# EAGLE design PS2_concentrate (EAGLE 6.2)
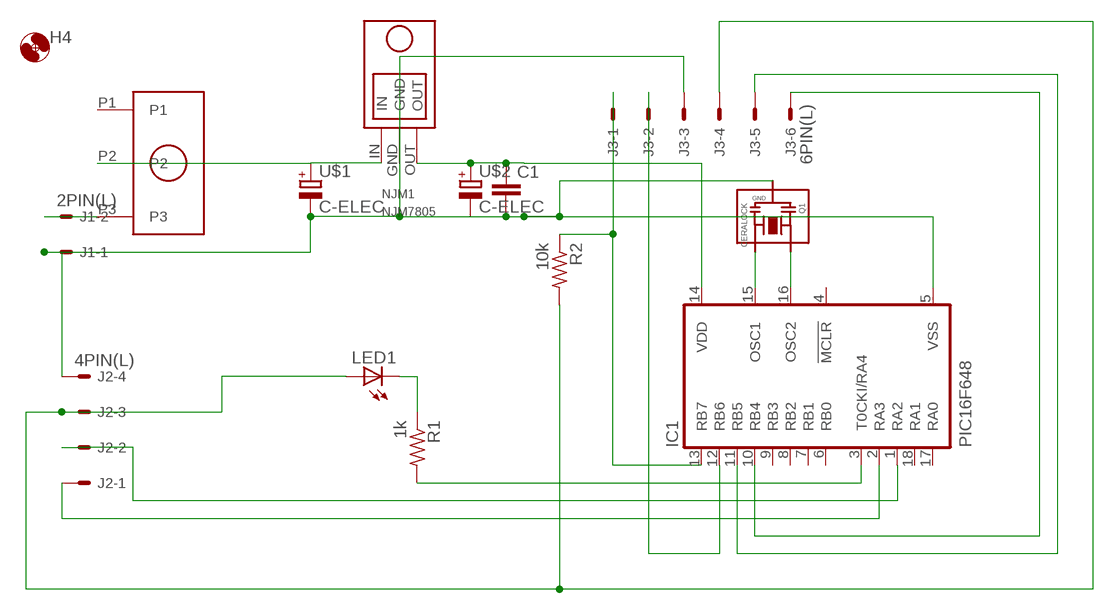
[diagram p0: schematic, sheet 1]

## Parts
C1  C-  [C-2.54]
H4  HOLE3.3M3BOLT  [HOLE3.3]
IC1  PIC16F648  [DIL18]
J1  2PIN(L)  [2PL]
J2  4PIN(L)  [4PL]
J3  6PIN(L)  [6PL]
LED1  LED  [LED5MM]
NJM1  NJM7805  [NJM7805]
Q1  CERALOCK  [CERALOCK]
R1  1k  R-  [0207/10]
R2  10k  R-  [0207/10]
U$1  C-ELEC  [C-6MM]
U$2  C-ELEC  [C-6MM]
U$3  TOGGLE_SEITCH  [TOGGLE_SWITCH]

## Nets
5V: C1.P$1 IC1.14(VDD) J2.3 J3.4 LED1.A NJM1.OUT R2.2 U$2.+
9V: NJM1.IN U$1.+ U$3.P2
A2: IC1.1(RA2) J2.2
A3: IC1.2(RA3) J2.1
A4: IC1.3(T0CKI/RA4) R1.2
B4: IC1.10(RB4) J3.6
B5: IC1.11(RB5) J3.5
B6: IC1.12(RB6) J3.2
B7: IC1.13(RB7) J3.1 R2.1
GND: C1.P$2 IC1.5(VSS) J1.1 J2.4 J3.3 NJM1.GND Q1.P$2 U$1.- U$2.-
N$2: LED1.K(C) R1.1
N$3: J1.2 U$3.P3
N$4: IC1.15(OSC1) Q1.P$3
N$5: IC1.16(OSC2) Q1.P$1
Unconnected: IC1.4(!MCLR) IC1.6(RB0) IC1.7(RB1) IC1.8(RB2) IC1.9(RB3) IC1.17(RA0) IC1.18(RA1) U$3.P1

## Library data of the parts
C1 = My_rcl:C-
H4 = FP-21T for MITS:HOLE3.3
IC1 = FP-21T for MITS:PIC16F648
J1 = my_connector:2PIN(L)
J2 = my_connector:4PIN(L)
J3 = my_connector:6PIN(L)
LED1 = my_led:LED: LED
NJM1 = My_NJM7805:NJM7805
Q1 = FP-21T for MITS:CERALOCK: CERALOCK CERAMIC RESONATOR
R1 R2 = My_rcl:R-: Resistor
U$1 U$2 = My_rcl:C-ELEC
U$3 = Toggle_Switch:TOGGLE_SEITCH

## Board
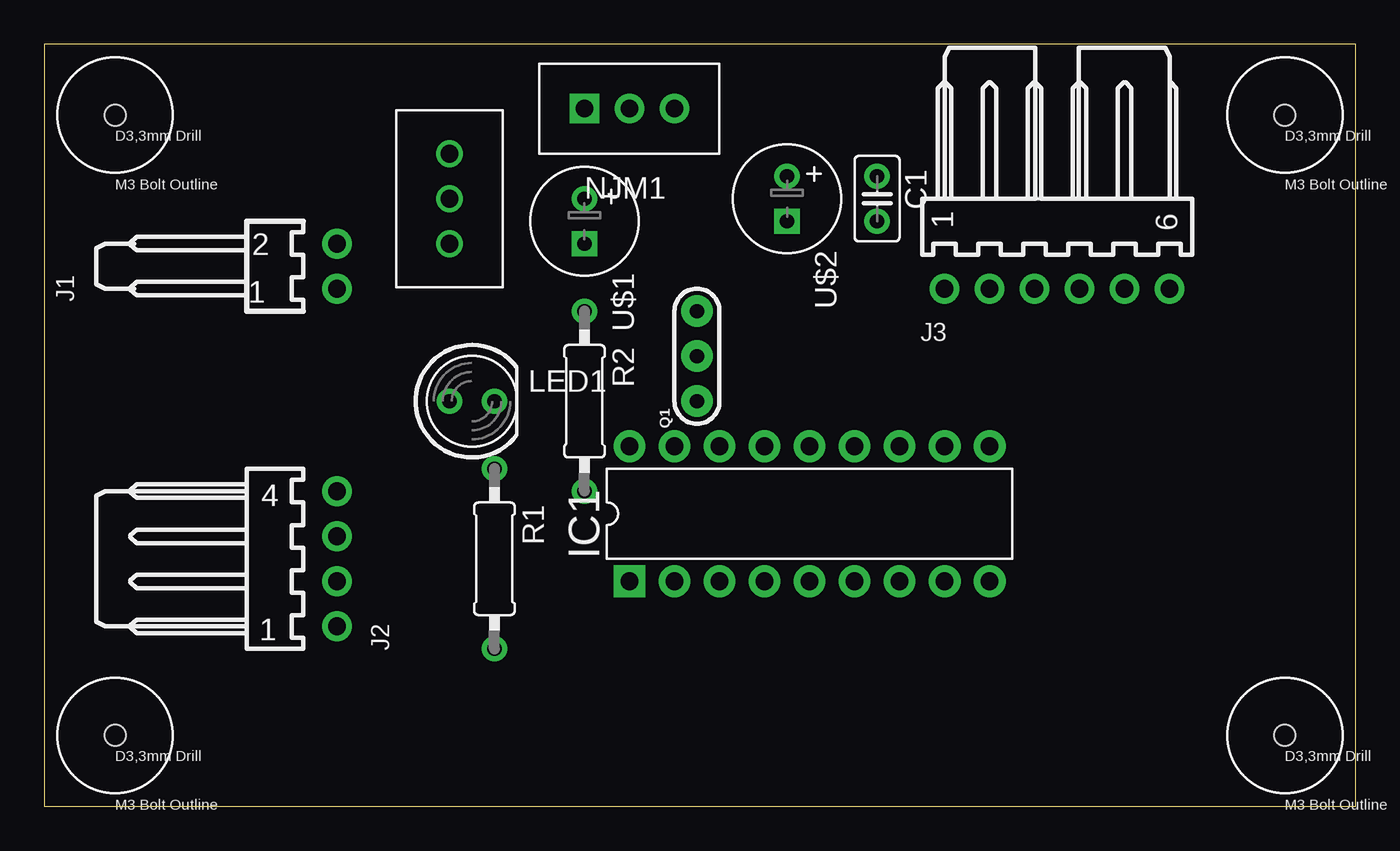
[diagram p1: board, top side]
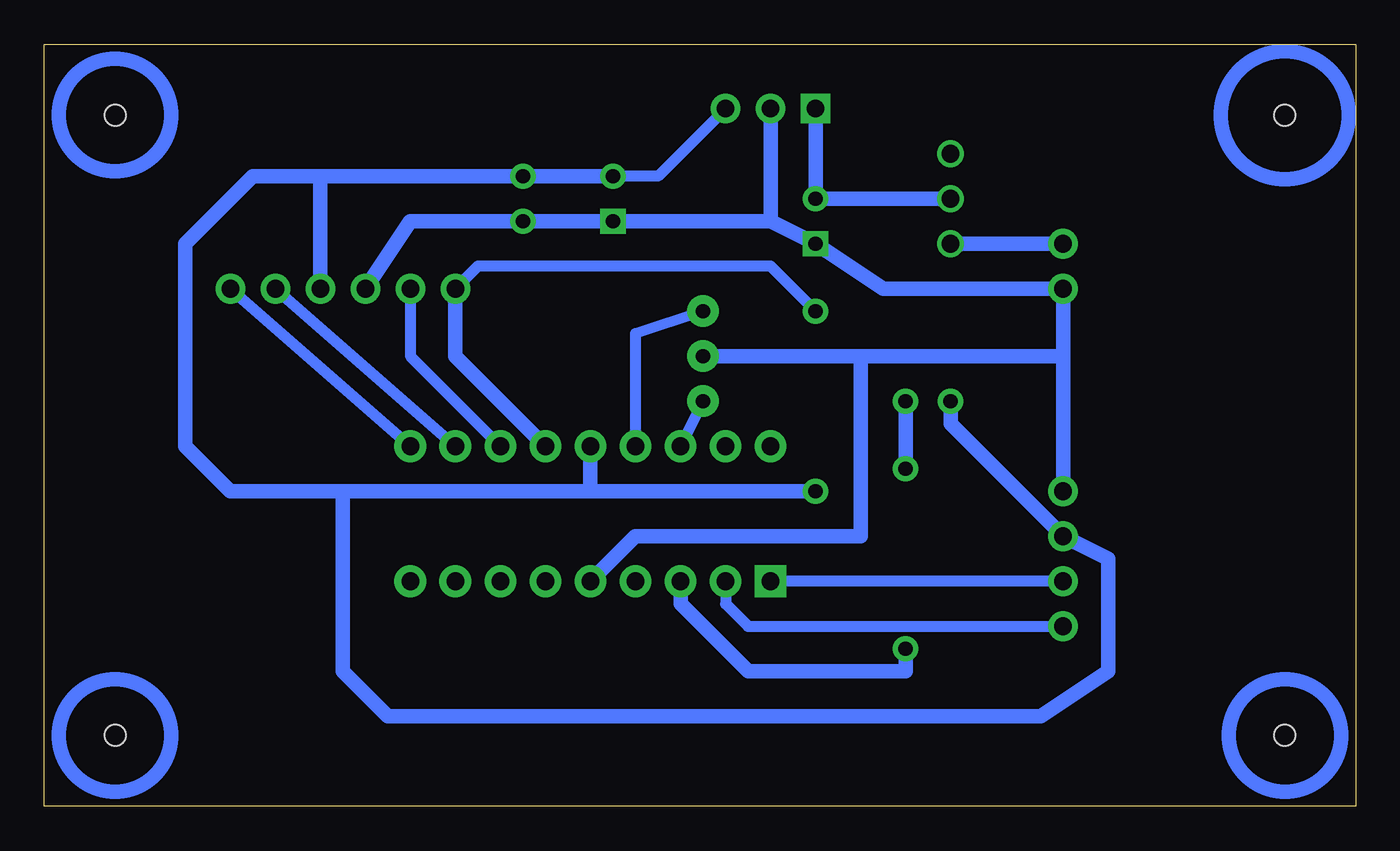
[diagram p2: board, bottom side, seen from below]

Size 74 x 43 mm. Coordinates in mm from the lower left corner, seen from the top.
Outline: 0,0 74,0 74,43 0,43 0,0
Copper layers (1*16): Top 0.035mm / dielectric 1.5mm / Bottom 0.035mm
Design rules: minimum track width 10mil, minimum drill 24mil, track to track 8mil, track to pad 8mil, pad to pad 8mil, via to via 8mil, smd to smd 8mil, copper to edge 40mil, drill to drill 8mil, minimum pad ring 10mil, minimum via ring 8mil, stop-mask expansion 4mil, vias tented up to drill 0mil, thermal gap 10mil

### Footprints (pad centres in the part's own frame; a part is rotated, then mirrored left to right if it is on the bottom)
C-2.54 = drill 0.8 pad 1.422: P$1 -1.27,0; P$2 1.27,0
HOLE3.3 = hole 1.2: 0,0
DIL18 = drill 1 pad 1.8 square: 1 -10.16,-3.81 | drill 1 pad 1.8: 2 -7.62,-3.81; 3 -5.08,-3.81; 4 -2.54,-3.81; 5 0,-3.81; 6 2.54,-3.81; 7 5.08,-3.81; 8 7.62,-3.81; 9 10.16,-3.81; 10 10.16,3.81; 11 7.62,3.81; 12 5.08,3.81; 13 2.54,3.81; 14 0,3.81; 15 -2.54,3.81; 16 -5.08,3.81; 17 -7.62,3.81; 18 -10.16,3.81
2PL = drill 1 pad 1.676: 1 -1.27,-7.62; 2 1.27,-7.62
4PL = drill 1 pad 1.676: 1 -3.81,-6.35; 2 -1.27,-6.35; 3 1.27,-6.35; 4 3.81,-6.35
6PL = drill 1 pad 1.676: 1 -6.35,-6.35; 2 -3.81,-6.35; 3 -1.27,-6.35; 4 1.27,-6.35; 5 3.81,-6.35; 6 6.35,-6.35
LED5MM = drill 0.8 pad 1.422: A -1.27,0; K 1.27,0
NJM7805 = drill 1 pad 1.676: GND 0,0; OUT 2.54,0 | drill 1 pad 1.676 square: IN -2.54,0
CERALOCK = drill 0.8 pad 1.778: P$1 -2.54,0; P$2 0,0; P$3 2.54,0
0207/10 = drill 0.8 pad 1.422: 1 -5.08,0; 2 5.08,0
C-6MM = drill 0.8 pad 1.422: + -1.27,0 | drill 0.8 pad 1.422 square: - 1.27,0
TOGGLE_SWITCH = drill 1 pad 1.422: P1 -2.54,0; P2 0,0; P3 2.54,0

### Placement (x,y rotation side)
C1  46.99,34.29 270 top
H1  HOLE3.3M3BOLT  [HOLE3.3]  4,39 0 top
H2  HOLE3.3M3BOLT  [HOLE3.3]  70,39 0 top
H3  HOLE3.3M3BOLT  [HOLE3.3]  70,4 0 top
H4  4,4 0 top
IC1  43.18,16.51 0 top
J1  8.89,30.48 90 top
J2  10.16,13.97 90 top
J3  57.15,35.56 0 top
LED1  24.13,22.86 0 top
NJM1  33.02,39.37 0 top
Q1  36.83,25.4 90 top
R1  25.4,13.97 270 top
R2  30.48,22.86 270 top
U$1  30.48,33.02 270 top
U$2  41.91,34.29 270 top
U$3  22.86,34.29 270 top

### Tracks (layer width: path | path; a pad name or v marks a point on that pad's centre or on a via)
5V
  Bottom 0.61: NJM1.OUT 39.37,35.56 U$2.+
  Bottom 0.813: U$2.+ C1.P$1 58.42,35.56 | 63.5,34.29 66.04,31.75 | 63.5,34.29 66.04,31.75 | 43.18,17.78 IC1.14 | 43.18,17.78 R2.2 57.15,17.78 | LED1.A 22.86,21.59 J2.3 13.97,13.97 13.97,7.62 17.78,5.08 53.34,5.08 54.61,5.08 57.15,7.62 57.15,17.78 | 58.42,35.56 J3.4 58.42,35.56 | 58.42,35.56 62.23,35.56 63.5,34.29 | 66.04,31.75 66.04,20.32 63.5,17.78 57.15,17.78 | 57.15,17.78 43.18,17.78
9V
  Bottom 0.813: U$3.P2 U$1.+ 30.48,35.56 NJM1.IN
A2
  Bottom 0.61: J2.2 IC1.1
A3
  Bottom 0.61: IC1.2 35.56,11.43 34.29,10.16 J2.1
A4
  Bottom 0.813: R1.2 25.4,7.62 34.29,7.62 38.1,11.43 IC1.3
B4
  Bottom 0.61: IC1.10 J3.6
B5
  Bottom 0.61: IC1.11 J3.5
B6
  Bottom 0.61: J3.2 53.34,25.4 IC1.12
B7
  Bottom 0.61: R2.1 33.02,30.48 49.53,30.48 J3.1
  Bottom 0.813: J3.1 50.8,25.4 IC1.13
GND
  Bottom 0.813: 33.02,33.02 U$1.- 26.67,29.21 J1.1 16.51,25.4 | 16.51,25.4 J2.4 | J3.3 53.34,33.02 C1.P$2 U$2.- 40.64,33.02 33.02,33.02 | Q1.P$2 27.94,25.4 | 27.94,25.4 16.51,25.4 | NJM1.GND 33.02,36.83 33.02,33.02 | IC1.5 40.64,15.24 27.94,15.24 27.94,25.4
N$2
  Bottom 0.813: LED1.K R1.1
N$3
  Bottom 0.813: J1.2 U$3.P3
N$4
  Bottom 0.61: Q1.P$3 40.64,26.67 IC1.15
N$5
  Bottom 0.61: IC1.16 Q1.P$1
(copper drawn outside any net)
  shapes: Bottom circle x4